# Altium schematic sheet Face_3Key1V0.SchDoc
size A3
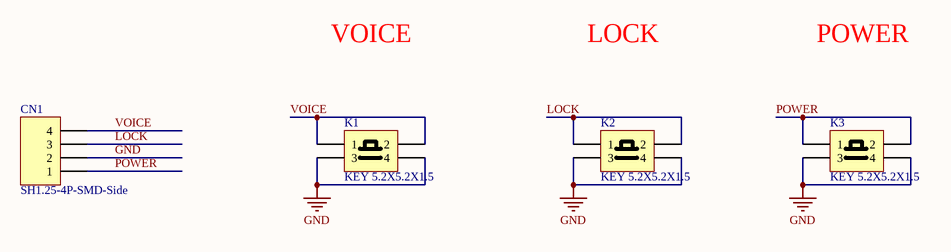
[diagram p0: Face_3Key1V0.SchDoc]

## Parts
CN1  name1: SH1.25-4P-SMD-Side  [SH1.25_4P_SMd_SIDE]  (hidden comment: SH1.25-4P-SMD-TOP)
K1  KEY 5.2X5.2X1.5  [5.2X5.2X1.5 TACT SWITCH]
K2  KEY 5.2X5.2X1.5  [5.2X5.2X1.5 TACT SWITCH]
K3  KEY 5.2X5.2X1.5  [5.2X5.2X1.5 TACT SWITCH]

## Nets
GND: CN1.2 K1.3 K1.4 K2.3 K2.4 K3.3 K3.4
LOCK: CN1.3 K2.1 K2.2
POWER: CN1.1 K3.1 K3.2
VOICE: CN1.4 K1.1 K1.2

## Notes on the sheet
- VOICE
- LOCK
- POWER
- Title
- Size:
- Date:
- A3
- Number:
- Time:
- Revision:
- Sheet
- of
- File:

## Library data of the parts
CN1 = Header4: 物料编号: ECZ02035; 名称: 弯针插座; 规格，型号: PH 2Pin 间距2.0mm DIP/90°; Parameter 1: PH2.0-4P-SMD-Top; Parameter 2: PH2.0-4P-SMD-Side
K1-K3 = Tactile Switch KEY6x6x14: 5.2X5.2X1.5 TACT SWITCH; LatestRevisionDate: 17-Jul-2002; LatestRevisionNote: Re-released for DXP Platform.; Publisher: Altium Limited